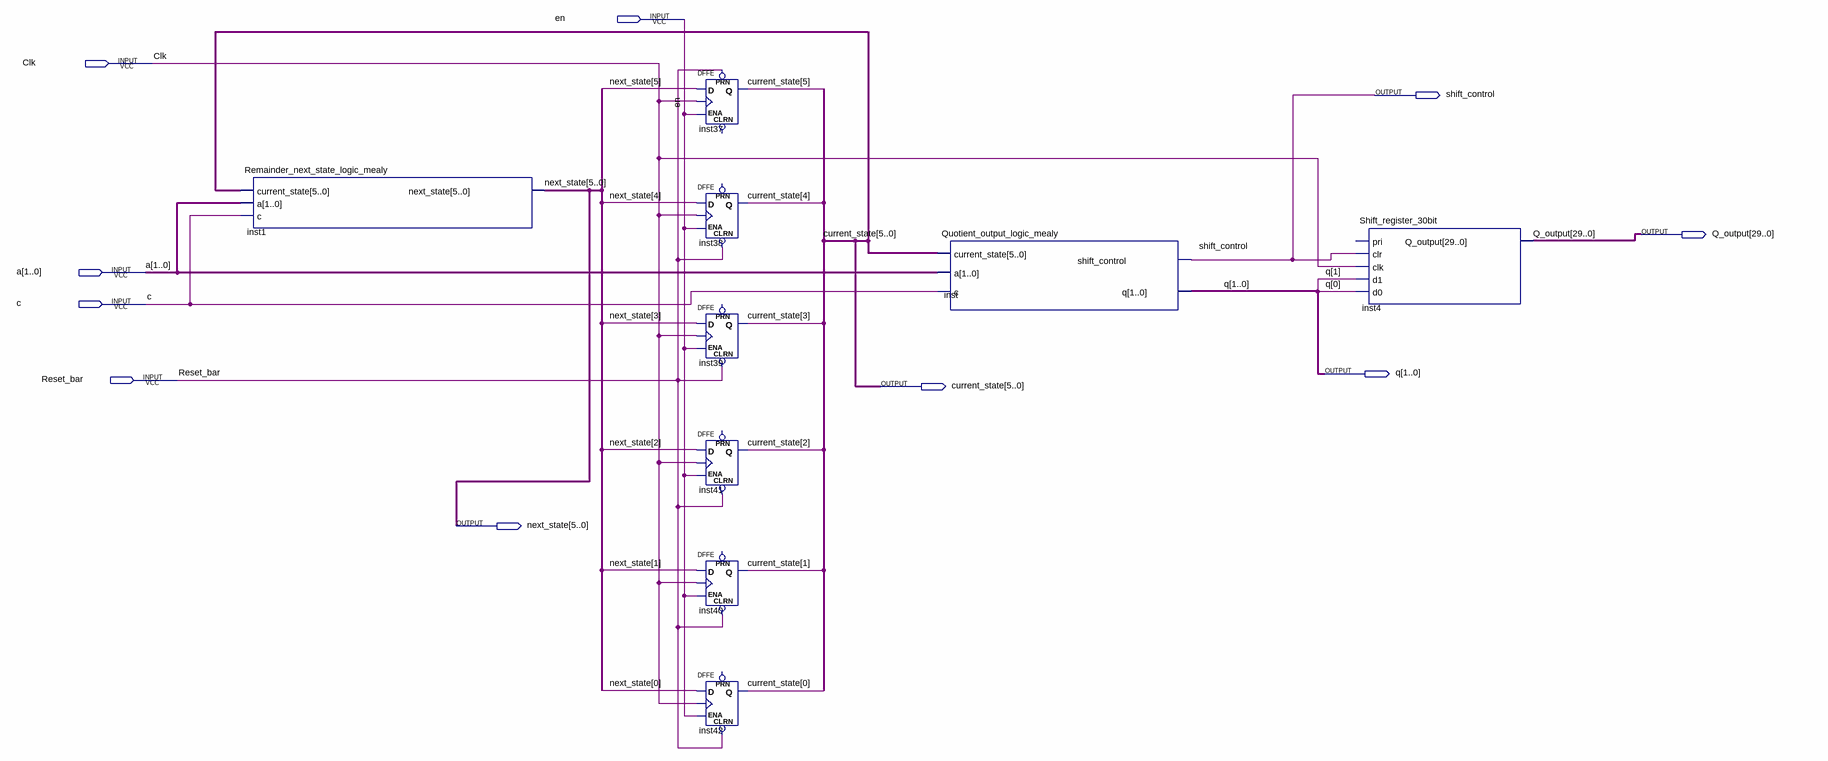
[diagram p0: schematic sheet]
// Quartus schematic Mealy_Project2.bdf as structural Verilog: 9 symbols, 10 pins
module Mealy_Project2 (
  input  en,
  input  Clk,
  input  [1:0] a,
  input  c,
  input  Reset_bar,
  output shift_control,
  output [29:0] Q_output,
  output [1:0] q,
  output [5:0] current_state,
  output [5:0] next_state
);

  Remainder_next_state_logic_mealy inst1 (.current_state(current_state), .a(a), .c(c), .next_state(next_state));
  DFFE inst37 (.PRN(Reset_bar), .D(next_state[5]), .CLK(Clk), .ENA(en), .Q(current_state[5]));  // open: CLRN
  DFFE inst38 (.CLRN(Reset_bar), .D(next_state[4]), .CLK(Clk), .ENA(en), .Q(current_state[4]));  // open: PRN
  DFFE inst39 (.CLRN(Reset_bar), .D(next_state[3]), .CLK(Clk), .ENA(en), .Q(current_state[3]));  // open: PRN
  DFFE inst41 (.CLRN(Reset_bar), .D(next_state[2]), .CLK(Clk), .ENA(en), .Q(current_state[2]));  // open: PRN
  DFFE inst40 (.CLRN(Reset_bar), .D(next_state[1]), .CLK(Clk), .ENA(en), .Q(current_state[1]));  // open: PRN
  DFFE inst42 (.CLRN(Reset_bar), .D(next_state[0]), .CLK(Clk), .ENA(en), .Q(current_state[0]));  // open: PRN
  Quotient_output_logic_mealy inst (.current_state(current_state), .a(a), .c(c), .shift_control(shift_control), .q(q));
  Shift_register_30bit inst4 (.clr(shift_control), .clk(Clk), .d1(q[1]), .d0(q[0]), .Q_output(Q_output));  // open: pri
endmodule
